# Altium schematic sheet lixie.schdoc
size 469 x 298 mm
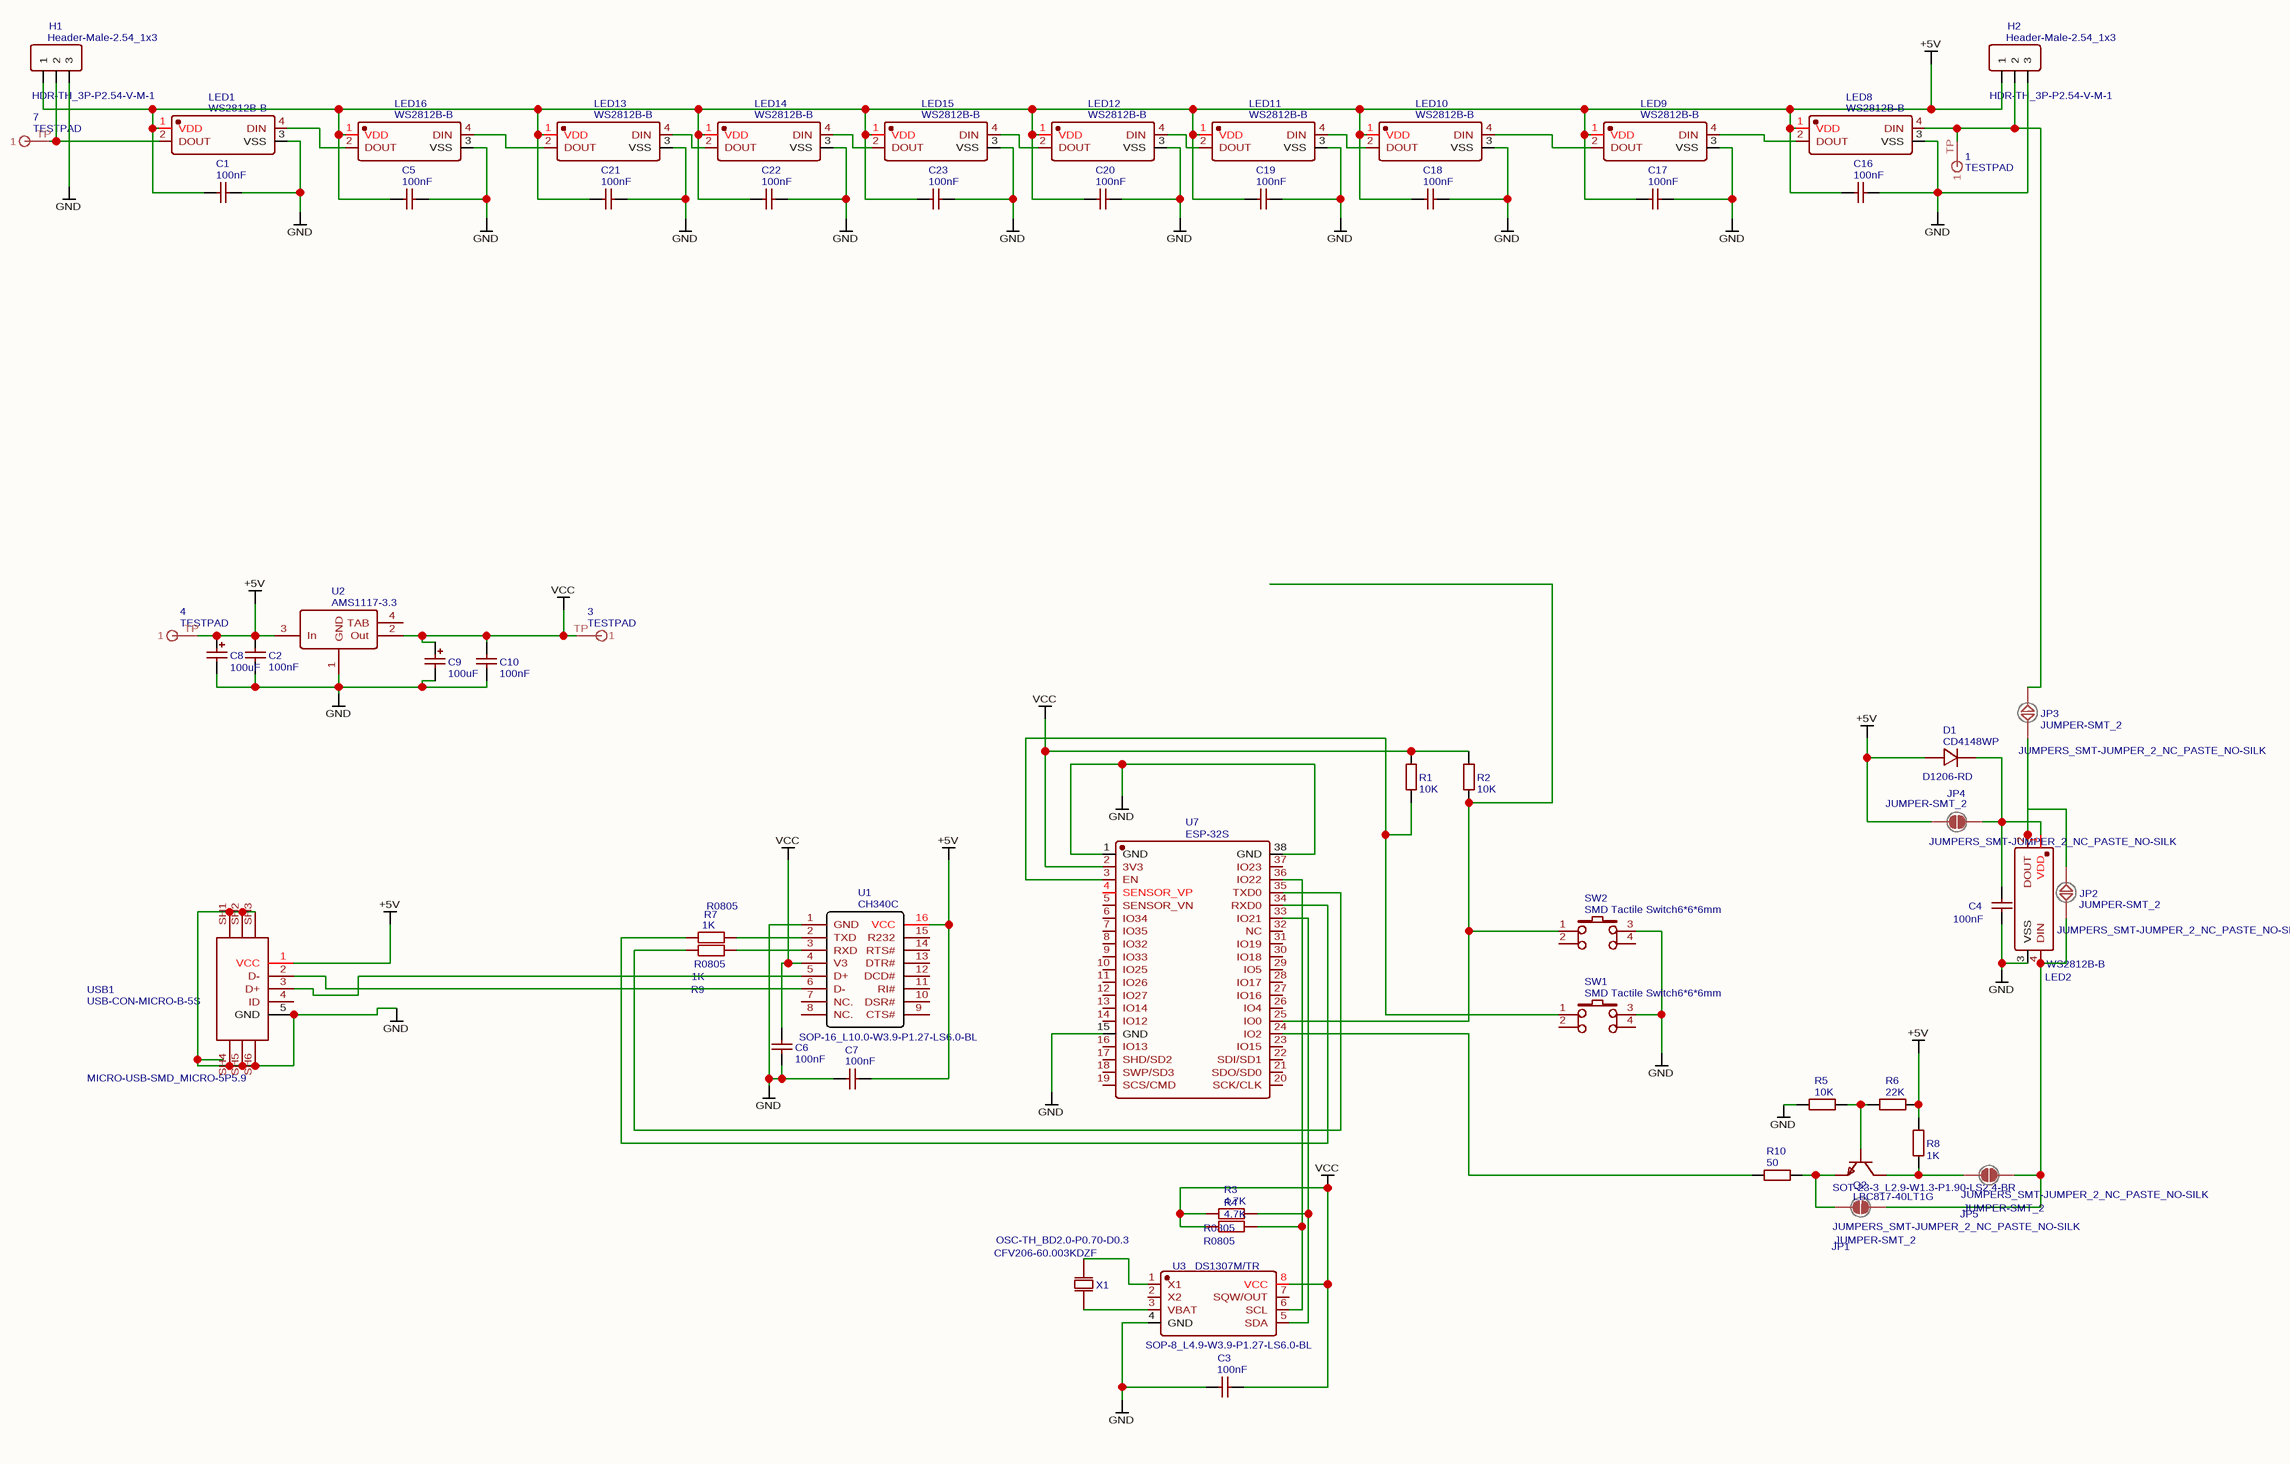
[diagram p0: lixie.schdoc]

## Parts
1  TESTPAD  [TESTPAD]
3  TESTPAD  [TESTPAD]
4  TESTPAD  [TESTPAD]
7  TESTPAD  [TESTPAD]
C1  100nF  [0805]
C2  100nF  [0805]
C3  100nF  [0805]
C4  100nF  [0805]
C5  100nF  [0805]
C6  100nF  [0805]
C7  100nF  [0805]
C8  100uF  [CAP-SMD_L3.5-W2.8]
C9  100uF  [CAP-SMD_L3.5-W2.8]
C10  100nF  [0805]
C16  100nF  [0805]
C17  100nF  [0805]
C18  100nF  [0805]
C19  100nF  [0805]
C20  100nF  [0805]
C21  100nF  [0805]
C22  100nF  [0805]
C23  100nF  [0805]
D1  CD4148WP  [D1206-RD]
H1  Header-Male-2.54_1x3  [HDR-TH_3P-P2.54-V-M-1]
H2  Header-Male-2.54_1x3  [HDR-TH_3P-P2.54-V-M-1]
JP1  JUMPER-SMT_2  [JUMPERS_SMT-JUMPER_2_NC_PASTE_NO-SILK]
JP2  JUMPER-SMT_2  [JUMPERS_SMT-JUMPER_2_NC_PASTE_NO-SILK]
JP3  JUMPER-SMT_2  [JUMPERS_SMT-JUMPER_2_NC_PASTE_NO-SILK]
JP4  JUMPER-SMT_2  [JUMPERS_SMT-JUMPER_2_NC_PASTE_NO-SILK]
JP5  JUMPER-SMT_2  [JUMPERS_SMT-JUMPER_2_NC_PASTE_NO-SILK]
LED1  WS2812B-B  [LED-5050_4P]
LED2  WS2812B-B  [LED-5050_4P]
LED8  WS2812B-B  [LED-5050_4P]
LED9  WS2812B-B  [LED-5050_4P]
LED10  WS2812B-B  [LED-5050_4P]
LED11  WS2812B-B  [LED-5050_4P]
LED12  WS2812B-B  [LED-5050_4P]
LED13  WS2812B-B  [LED-5050_4P]
LED14  WS2812B-B  [LED-5050_4P]
LED15  WS2812B-B  [LED-5050_4P]
LED16  WS2812B-B  [LED-5050_4P]
Q2  LBC817-40LT1G  [SOT-23-3_L2.9-W1.3-P1.90-LS2.4-BR]
R1  10K  [0805]
R2  10K  [0805]
R3  4.7K  [R0805]
R4  4.7K  [R0805]
R5  10K  [0805]
R6  22K  [0805]
R7  1K  [R0805]
R8  1K  [0805]
R9  1K  [R0805]
R10  50  [0805]
SW1  SMD Tactile Switch6*6*6mm  [SW-SMD_4PIN-L6.00-W6.00]
SW2  SMD Tactile Switch6*6*6mm  [SW-SMD_4PIN-L6.00-W6.00]
U1  CH340C  [SOP-16_L10.0-W3.9-P1.27-LS6.0-BL]
U2  AMS1117-3.3  [SOT-223_L6.5-W3.5-P2.30-LS7.0-BR]
U3  DS1307M/TR  [SOP-8_L4.9-W3.9-P1.27-LS6.0-BL]
U7  ESP-32S  [WIFIM-SMD_ESP-32S]
USB1  USB-CON-MICRO-B-5S  [MICRO-USB-SMD_MICRO-5P5.9]
X1  CFV206-60.003KDZF  [OSC-TH_BD2.0-P0.70-D0.3]

## Nets
+5V: 4.TP(1) C1.1 C2.2 C5.1 C7.2 C8.1 C16.1 C17.1 C18.1 C19.1 C20.1 C21.1 C22.1 C23.1 D1.2(A) H1.1 H2.1 JP4.1 LED1.1(VDD) LED8.1(VDD) LED9.1(VDD) LED10.1(VDD) LED11.1(VDD) LED12.1(VDD) LED13.1(VDD) LED14.1(VDD) LED15.1(VDD) LED16.1(VDD) R6.2 R8.2 U1.16(VCC) U2.3(In) USB1.1(VCC)
GND: C1.2 C2.1 C3.2 C4.2 C5.2 C6.2 C7.1 C8.2 C9.2 C10.1 C16.2 C17.2 C18.2 C19.2 C20.2 C21.2 C22.2 C23.2 H1.3 H2.3 LED1.3(VSS) LED2.3(VSS) LED8.3(VSS) LED9.3(VSS) LED10.3(VSS) LED11.3(VSS) LED12.3(VSS) LED13.3(VSS) LED14.3(VSS) LED15.3(VSS) LED16.3(VSS) R5.1 SW1.3 SW2.3 U1.1(GND) U2.1(GND) U3.4(GND) U7.1(GND) U7.15(GND) U7.38(GND) USB1.5(GND) USB1.SH1 USB1.SH2 USB1.SH3 USB1.SH4 USB1.SH5 USB1.SH6
VCC: 3.TP(1) C3.1 C6.1 C9.1 C10.2 R1.2 R2.2 R3.1 R4.1 U1.4(V3) U2.2(Out) U3.8(VCC) U7.2(3V3)
Net1_TP: 1.TP(1) H2.2 JP3.1 LED8.4(DIN)
Net7_TP: 7.TP(1) H1.2 LED1.2(DOUT)
NetC4_1: C4.1 D1.1(C) JP4.2 LED2.1(VDD)
NetJP1_1: JP1.1 Q2.2(E) R10.2
NetJP1_2: JP1.2 JP2.2 JP5.2 LED2.4(DIN)
NetJP2_1: JP2.1 JP3.2 LED2.2(DOUT)
NetJP5_1: JP5.1 Q2.3(C) R8.1
NetLED1_4: LED1.4(DIN) LED16.2(DOUT)
NetLED8_2: LED8.2(DOUT) LED9.4(DIN)
NetLED9_2: LED9.2(DOUT) LED10.4(DIN)
NetLED10_2: LED10.2(DOUT) LED11.4(DIN)
NetLED11_2: LED11.2(DOUT) LED12.4(DIN)
NetLED12_2: LED12.2(DOUT) LED15.4(DIN)
NetLED13_2: LED13.2(DOUT) LED16.4(DIN)
NetLED13_4: LED13.4(DIN) LED14.2(DOUT)
NetLED14_4: LED14.4(DIN) LED15.2(DOUT)
NetQ2_1: Q2.1(B) R5.2 R6.1
NetR1_1: R1.1 SW1.1 U7.3(EN)
NetR2_1: R2.1 SW2.1 U7.25(IO0)
NetR3_2: R3.2 U3.5(SDA) U7.33(IO21)
NetR4_2: R4.2 U3.6(SCL) U7.36(IO22)
NetR7_1: R7.1 U7.34(RXD0)
NetR7_2: R7.2 U1.2(TXD)
NetR9_1: R9.1 U7.35(TXD0)
NetR9_2: R9.2 U1.3(RXD)
NetR10_1: R10.1 U7.24(IO2)
NetU1_5: U1.5(D+) U1.6(D-) USB1.2(D-) USB1.3(D+)
NetU3_1: U3.1(X1) X1.1(OSC1)
NetU3_3: U3.3(VBAT) X1.2(OSC2)

Not connected (* = marked no-connect by the designer): SW1 2 4; SW2 2 4; U1 7(NC.) 8(NC.) 9(CTS#) 10(DSR#) 11(RI#) 12(DCD#) 13(DTR#) 14(RTS#) 15(R232); U2 4(TAB); U3 2(X2) 7(SQW/OUT); U7 4(SENSOR_VP) 5(SENSOR_VN) 6(IO34) 7(IO35) 8(IO32) 9(IO33) 10(IO25) 11(IO26) 12(IO27) 13(IO14) 14(IO12) 16(IO13) 17(SHD/SD2) 18(SWP/SD3) 19(SCS/CMD) 20(SCK/CLK) 21(SDO/SD0) 22(SDI/SD1) 23(IO15) 26(IO4) 27(IO16) 28(IO17) 29(IO5) 30(IO18) 31(IO19) 32(NC) 37(IO23); USB1 4(ID)

## Notes on the sheet
- (in symbol 1K) R0805
- (in symbol 4.7K) R0805
- (in symbol CD4148WP) D1206-RD
- (in symbol CFV206-60.003KDZF) OSC-TH_BD2.0-P0.70-D0.3
- (in symbol CH340C) SOP-16_L10.0-W3.9-P1.27-LS6.0-BL
- (in symbol DS1307M/TR) SOP-8_L4.9-W3.9-P1.27-LS6.0-BL
- (in symbol Header-Male-2.54_1x3) HDR-TH_3P-P2.54-V-M-1
- (in symbol JUMPER-SMT_2) JUMPERS_SMT-JUMPER_2_NC_PASTE_NO-SILK
- (in symbol LBC817-40LT1G) SOT-23-3_L2.9-W1.3-P1.90-LS2.4-BR
- (in symbol USB-CON-MICRO-B-5S) MICRO-USB-SMD_MICRO-5P5.9

## Library data of the parts
1 3 4 7 = TESTPAD: Contributor: Time God; spicePre: ?
C1-C7 C10 C16-C23 = 100nF: BOM_Manufacturer Part: CC0805KRX7R9BB104; BOM_Manufacturer: YAGEO; nameAlias: Capacitance; SMT Type: Basic; BOM_Supplier: LCSC; BOM_LCSC Assembly: Yes; BOM_Supplier Part: C49678; spicePre: C; spiceSymbolName: CC0805KRX7R9BB104
C8 C9 = 100uF: BOM_Manufacturer: AVX; BOM_Manufacturer Part: TAJB107K006RNJ; nameAlias: Capacitance; SMT Type: Basic; BOM_Supplier: LCSC; BOM_LCSC Assembly: Yes; BOM_Supplier Part: C16133; spicePre: C; spiceSymbolName: TAJB107K006RNJ
D1 = CD4148WP: BOM_Manufacturer: LIZ; Package Display: Yes; BOM_Supplier: LCSC; BOM_Manufacturer Part: CD4148WP; BOM_Supplier Part: C109000; BOM_JLCPCB Part Class: Extended Part; spicePre: D; spiceSymbolName: CD4148WP
H1 H2 = Header-Male-2.54_1x3: BOM_Manufacturer: BOOMELE; BOM_Manufacturer Part: Header2.54mm 1*3P; Package Display: Yes; BOM_Supplier: LCSC; BOM_Supplier Part: C49257; BOM_JLCPCB Part Class: Extended Part; spicePre: H; spiceSymbolName: Header-Male-2.54_1x3
JP1-JP5 = JUMPER-SMT_2: Contributor: Celeron; Package Display: Yes; spicePre: J; spiceSymbolName: JUMPER-SMT_2
LED1 LED2 LED8-LED16 = WS2812B-B: BOM_Manufacturer: Worldsemi; Contributor: LCSC; BOM_Supplier: LCSC; BOM_Manufacturer Part: WS2812B-B; BOM_Supplier Part: C114586; spicePre: L
Q2 = LBC817-40LT1G: BOM_Manufacturer: LRC; Package Display: Yes; BOM_Supplier: LCSC; BOM_Manufacturer Part: LBC817-40LT1G; BOM_Supplier Part: C12767; BOM_JLCPCB Part Class: Extended Part; spicePre: Q; spiceSymbolName: LBC817-40LT1G
R1 R2 R5 = 10K: BOM_Manufacturer: UniOhm; BOM_Manufacturer Part: 0805W8F1002T5E; nameAlias: Resistance (Ohms); SMT Type: Basic; BOM_Supplier: LCSC; BOM_LCSC Assembly: Yes; BOM_Supplier Part: C17414; spicePre: R; spiceSymbolName: 0805W8F1002T5E
R3 R4 = 4.7K: BOM_Manufacturer: Tyohm; BOM_Manufacturer Part: RMC08054.7K5%N; nameAlias: Resistance (Ohms); Contributor: LCSC; Package Display: Yes; BOM_Supplier: LCSC; BOM_Supplier Part: C269733; BOM_JLCPCB Part Class: Extended Part; spicePre: R; spiceSymbolName: CR0805F4K7P05
R6 = 22K: BOM_Manufacturer: Ever Ohms Tech; BOM_Manufacturer Part: CR0805J22KP05; nameAlias: Resistance (Ohms); SMT Type: Basic; BOM_Supplier: LCSC; BOM_LCSC Assembly: Yes; BOM_Supplier Part: C245415; spicePre: R; spiceSymbolName: 0805W8F1002T5E
R7 R9 = 1K: BOM_Manufacturer: TAITEC; BOM_Manufacturer Part: FCM2012KF-102T04; nameAlias: Resistance (Ohms); Contributor: LCSC; Package Display: Yes; BOM_Supplier: LCSC; BOM_Supplier Part: C155076; BOM_JLCPCB Part Class: Extended Part; spicePre: R; spiceSymbolName: RMS10FT1001
R8 = 1K: BOM_Manufacturer: TAITEC; BOM_Manufacturer Part: FCM2012KF-102T04; nameAlias: Resistance (Ohms); SMT Type: Basic; BOM_Supplier: LCSC; BOM_LCSC Assembly: Yes; BOM_Supplier Part: C155076; spicePre: R; spiceSymbolName: 0805W8F1002T5E
R10 = 50: BOM_Manufacturer: UniOhm; BOM_Manufacturer Part: 0805W8F1002T5E; nameAlias: Resistance (Ohms); SMT Type: Basic; BOM_Supplier: LCSC; BOM_LCSC Assembly: Yes; BOM_Supplier Part: C17414; spicePre: R; spiceSymbolName: 0805W8F1002T5E
SW1 SW2 = SMD Tactile Switch6*6*6mm: BOM_Manufacturer: ReliaPro; BOM_Supplier Part: C23873; BOM_Supplier: LCSC; BOM_Manufacturer Part: SMD Tactile Switch6*6*6mm; image: http://image.lceda.cn/szlcsc/C23873.jpg; spicePre: S
U1 = CH340C: BOM_Manufacturer: WCH; Package Display: Yes; BOM_Supplier: LCSC; BOM_Manufacturer Part: CH340C; BOM_Supplier Part: C84681; BOM_JLCPCB Part Class: Extended Part; spicePre: U; spiceSymbolName: CH340C
U2 = AMS1117-3.3: BOM_Manufacturer: AMS; sourceId: dwIGgezVh; SMT Type: Basic; timeStamp: 1476261164; BOM_Supplier: LCSC; BOM_Manufacturer Part: AMS1117-3.3; BOM_LCSC Assembly: Yes; image: //image.lceda.cn/szlcsc/C6186.jpg; BOM_Supplier Part: C6186; spicePre: U
U3 = DS1307M/TR: BOM_Manufacturer: HGSEMI; Contributor: LCSC; Package Display: Yes; BOM_Supplier: LCSC; BOM_Supplier Part: C356706; BOM_Manufacturer Part: DS1307M/TR; BOM_JLCPCB Part Class: Extended Part; spicePre: U; spiceSymbolName: DS1307M/TR
U7 = ESP-32S: BOM_Manufacturer: Ai-Thinker; Contributor: LCSC; BOM_Supplier: LCSC; BOM_Supplier Part: C82899; BOM_Manufacturer Part: ESP-32S; spicePre: U
USB1 = USB-CON-MICRO-B-5S: BOM_Manufacturer: ValuePro; Package Display: Yes; BOM_Supplier: LCSC; BOM_Manufacturer Part: USB-CON-MICRO-B-5S; BOM_Supplier Part: C40954; BOM_JLCPCB Part Class: Extended Part; spicePre: U; spiceSymbolName: USB-CON-MICRO-B-5S
X1 = CFV206-60.003KDZF: BOM_Manufacturer: CITIZEN; Contributor: LCSC; Package Display: Yes; BOM_Supplier: LCSC; BOM_Supplier Part: C389957; BOM_Manufacturer Part: CFV206-60.003KDZF; BOM_JLCPCB Part Class: Extended Part; spicePre: X; spiceSymbolName: CFV206-60.003KDZF